# Altium project Allsky Sensor PCB.PrjPcb
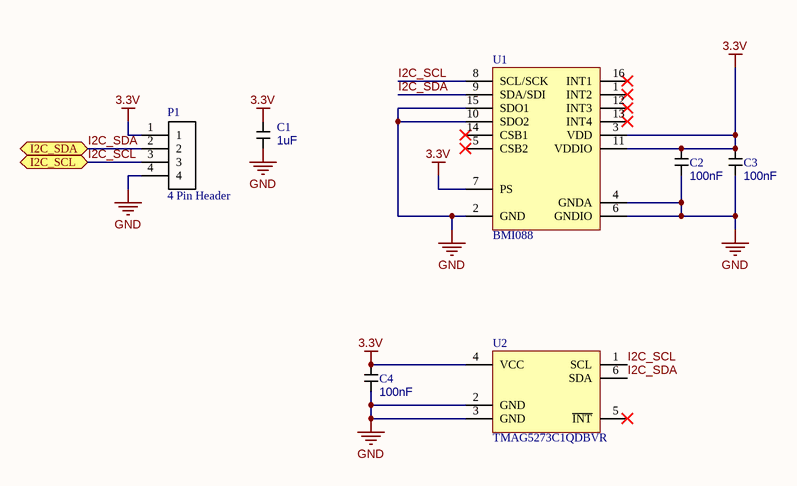
[diagram p0: Allsky Sensor PCB.SchDoc]
1 sheet, 8 parts. Net scope: flat (ports and power ports of the same name join across sheets).

## Sheet Allsky Sensor PCB.SchDoc
size A3

### Parts
?  (no value)
C1  Capacitance: 1uF  [C0805]  (hidden comment: F)
C2  Capacitance: 100nF  [C0805]  (hidden comment: F)
C3  Capacitance: 100nF  [C0805]  (hidden comment: F)
C4  Capacitance: 100nF  [C0805]  (hidden comment: F)
P1  4 Pin Header  [B4B-XH-A]
U1  BMI088  [BMI088]
U2  TMAG5273C1QDBVR  [TMAG5273C1QDBVR]

### Ports
I2C_SCL, I2C_SDA

### Nets
3.3V: C1.1 C2.1 C3.1 C4.1 P1.1 U1.3(VDD) U1.7(PS) U1.11(VDDIO) U2.4(VCC)
GND: C1.2 C2.2 C3.2 C4.2 P1.4 U1.2(GND) U1.4(GNDA) U1.6(GNDIO) U1.10(SDO2) U1.15(SDO1) U2.2(GND) U2.3(GND)
I2C_SCL: P1.3 U1.8(SCL/SCK) U2.1(SCL) ; port I2C_SCL
I2C_SDA: P1.2 U1.9(SDA/SDI) U2.6(SDA) ; port I2C_SDA

Not connected (* = marked no-connect by the designer): U1 1(INT2)* 5(CSB2)* 12(INT3)* 13(INT4)* 14(CSB1)* 16(INT1)*; U2 5(~{INT})*

### Notes on the sheet
- DRAWN BY
- CHECKED BY
- DATE
- TITLE
- Title
- Size:
- Date:
- A3
- Number:
- Time:
- Revision:
- Sheet
- of
- APPROVED BY
- RELEASED BY
- SCALE:
- SIZE
- DRAWING NUMBER
- SHEET
- -
- OF
- File:

### Library data of the parts
? = Title Block
C1 = Capacitor: Manufacturer: Samsung Electro-Mechanics; Manufacturer Part Number: CL21B105KAFNNNE; Voltage Rating: 25V; Supplier: Digi-Key Electronics; Supplier Part Number: 1276-1066-1-ND; Price: 0.16
C2-C4 = Capacitor: Manufacturer: Samsung Electro-Mechanics; Manufacturer Part Number: CL21B104KBCNNNC; Voltage Rating: 50V; Supplier: Digi-Key Electronics; Supplier Part Number: 1276-1003-1-ND; Price: 0.16
P1 = Header 4: Manufacturer: JST; Manufacturer Part Number: B4B-XH-2; Supplier: Digi-Key Electronics; Supplier Part Number: 455-B4B-XH-A-ND
U1 = BMI088: Accelerometer, Gyroscope, 6 Axis Sensor I2C, SPI Output; Manufacturer: Bosch Sensortec; Supplier: Digi-Key Electronics; Supplier Part Number: 828-1082-1-ND; Manufacturer Part Number: BMI088
U2 = TMAG5273C1QDBVR: Hall Effect Sensor X, Y, Z Axis SOT-23-6; Manufacturer: Texas Instruments; Manufacturer Part Number: TMAG5273C1QDBVR; Supplier: Digi-Key Electronics; Supplier Part Number: 296-TMAG5273C1QDBVRCT-ND